# Altium schematic sheet Atmaca.SchDoc
size A4
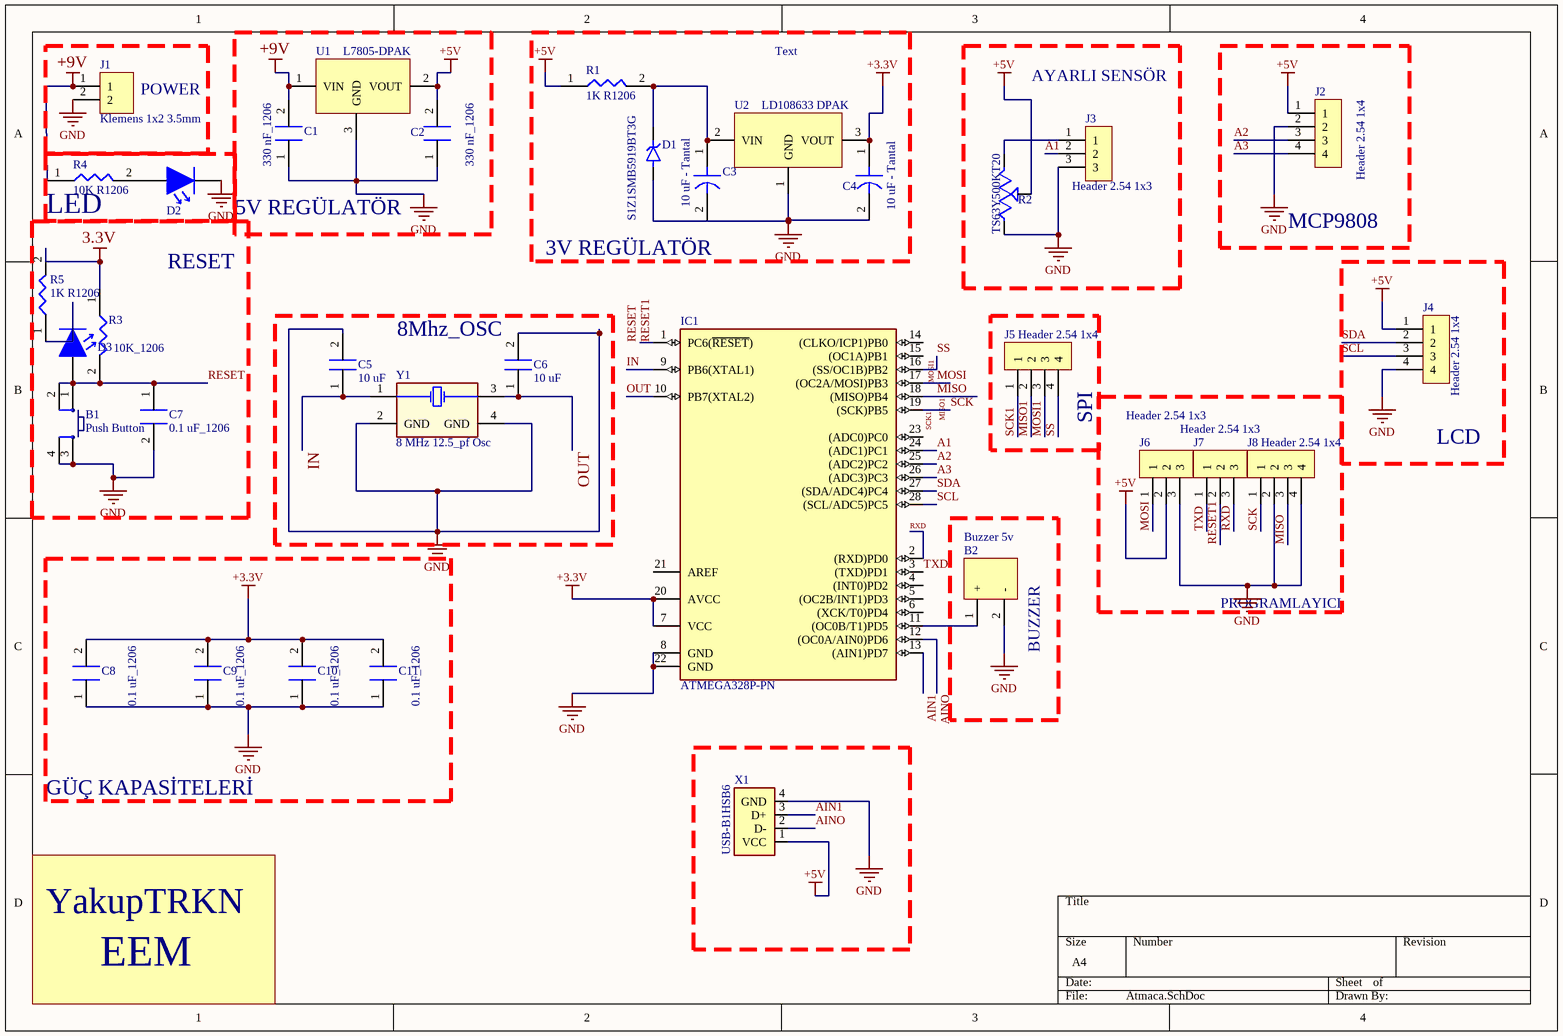
[diagram p0: Atmaca.SchDoc]

## Parts
B1  Push Button  [PUSB BUTTON-SMD]
B2  Buzzer 5v  [Buzzer 5v]
C1  330 nF_1206  [C1206]
C2  330 nF_1206  [C1206]
C3  10 uF - Tantal  [C1206- TANTAL]
C4  10 uF - Tantal  [C1206- TANTAL]
C5  10 uF  [C1206]
C6  10 uF  [C1206]
C7  0.1 uF_1206  [C1206]
C8  0.1 uF_1206  [C1206]
C9  0.1 uF_1206  [C1206]
C10  0.1 uF_1206  [C1206]
C11  0.1 uF_1206  [C1206]
D1  S1Z1SMB5919BT3G  [DIOM5436X247N]
D2  LTST-C171GKT  [LED_GREEN_0805]  (value not drawn)
D3  LH R974-LP-1  [LED_RED_0805]  (value not drawn)
IC1  ATMEGA328P-PN  [DIL28]
J1  Klemens 1x2 3.5mm  [Klemens 1x2 - 3.5mm]
J2  Header 2.54 1x4  [Header 2.54 1x4]
J3  Header 2.54 1x3  [Header 2.54 1x3]
J4  Header 2.54 1x4  [Header 2.54 1x4]
J5  Header 2.54 1x4  [Header 2.54 1x4]
J6  Header 2.54 1x3  [Header 2.54 1x3]
J7  Header 2.54 1x3  [Header 2.54 1x3]
J8  Header 2.54 1x4  [Header 2.54 1x4]
R1  1K R1206  [R1206 Resıstor]
R2  TS63Y500KT20  [TRIM_TS63Y500KT20]
R3  10K_1206  [R1206 Resıstor]
R4  10K R1206  [R1206 Resıstor]
R5  1K R1206  [R1206 Resıstor]
U1  L7805-DPAK  [DPAK228P972X230-3N]
U2  LD108633 DPAK  [DPAK228P972X230-3N]
X1  USB-B1HSB6  [OST_USB-B1HSB6]
Y1  8 MHz 12.5_pf Osc  [8 MHZ Osc.]

## Nets
3.3V: R3.1 R5.2
+3.3V: C4.1 C8.2 C9.2 C10.2 C11.2 IC1.7(VCC) IC1.20(AVCC) U2.3(VOUT)
+5V: C2.2 J2.1 J4.1 J6.2 R1.1 R2.2(B) U1.2(VOUT) X1.1(VCC)
+9V: C1.2 J1.1 R4.1 U1.1(VIN)
GND: B1.3 B1.4 B2.2(-) C1.1 C2.1 C4.2 C5.2 C6.2 C7.2 C8.1 C9.1 C10.1 C11.1 D1.A D2.1 IC1.8(GND) IC1.22(GND) J1.2 J2.2 J3.3 J4.4 J6.3 J8.2 J8.4 R2.1(A) U1.3(GND) U2.1(GND) X1.4(GND) Y1.2(GND) Y1.4(GND)
A1: IC1.24((ADC1)PC1) J3.2
A2: IC1.25((ADC2)PC2) J2.3
A3: IC1.26((ADC3)PC3) J2.4
AIN1: IC1.13((AIN1)PD7) X1.3(D+)
AINO: IC1.12((OC0A/AIN0)PD6) X1.2(D-)
IN: C5.1 IC1.9(PB6(XTAL1)) Y1.1
MISO: IC1.18((MISO)PB4) J5.2 J8.3  [also labelled MISO1]
MOSI: IC1.17((OC2A/MOSI)PB3) J5.3 J6.1  [also labelled MOSI1]
OUT: C6.1 IC1.10(PB7(XTAL2)) Y1.3
RESET: B1.1 B1.2 C7.1 D3.2 IC1.1(PC6(~{RESET})) J7.2 R3.2  [also labelled RESET1]
RXD: IC1.2((RXD)PD0) J7.3
SCK: IC1.19((SCK)PB5) J5.1 J8.1  [also labelled SCK1]
SCL: IC1.28((SCL/ADC5)PC5) J4.3
SDA: IC1.27((SDA/ADC4)PC4) J4.2
SS: IC1.16((SS/OC1B)PB2) J5.4
TXD: IC1.3((TXD)PD1) J7.1
NetB2_1: B2.1(+) IC1.11((OC0B/T1)PD5)
NetC3_1: C3.1 D1.C(K) R1.2 U2.2(VIN)
NetD2_2: D2.2 R4.2
NetD3_1: D3.1 R5.1
NetJ3_1: J3.1 R2.3(C)

Not connected (* = marked no-connect by the designer): C3 2; IC1 4((INT0)PD2) 5((OC2B/INT1)PD3) 6((XCK/T0)PD4) 14((CLKO/ICP1)PB0) 15((OC1A)PB1) 21(AREF) 23((ADC0)PC0)

## Notes on the sheet
- (near J1) POWER
- Text
- AYARLI SENSÖR
- (near R4) LED
- 5V REGÜLATÖR
- MCP9808
- RESET
- 3V REGÜLATÖR
- 8Mhz_OSC
- (near J5) SPI
- LCD
- (near B2) BUZZER
- PROGRAMLAYICI
- GÜÇ KAPASİTELERİ
- YakupTRKN
- EEM

## Library data of the parts
B1 = Push Button: Smd Push Button; Satın Alma Linki: https://urun.n11.com/diger/mini-pushbutton-switch-smd-P227461537?gclid=Cj0KCQjwkoDmBRCcARIsAG3xzl8Y_-jeD7HocNM6lvuZ_rVp83568XPGtNzlPwXWLph8oCRqo0yh87UaApZYEALw_wcB&gclsrc=aw.ds
C1 C2 = 330 nF C1206
C7-C11 = 0.1 uF C1206
D1 = S1Z1SMB5919BT3G: Zener Diode 5.6V 3W Â±5% Surface Mount SMB; MF: {'manufacturer': u'ON Semiconductor'}; Availability: Unavailable; MP: S1Z1SMB5919BT3G; Value: *; Package: None; Price: None
D2 = LED GREEN 0805: Green 0805 130 º Min 5 mcd Typical 12 mcd Water Clear Lens SMT LED; Manufacturer: Vishay Lite-On; Designed by: BERK; Lens Color: Colorless; Viewing Angle: 130°; Lens Style: Diffused,Colorless,Rectangular,Clear; Luminous Intensity: 12mcd; Forward Current: 30mA; Forward Voltage: 2.1V; Power Rating: 100mW; Dominant Wavelength: 569nm; Test Current: 10mA; Number of Elements: 1; Wavelength: 585nm; Reverse Voltage: 5V; Supplier 1: Digi-Key; Manufacturer Part Number: LTST-C171GKT; RoHS: Yes; Category: LEDs; Stock 1: 159023; Pricing 1: 1=0,26000, 10=0,14100, 100=0,06560, 500=0,06060, 1000=0,04747 (USD); Mount: Surface Mount; Case/Package: 0805; Number of Pins: 2; Color: Green; Case Code (Metric): 2012; Case Code (Imperial): 0805; Min Operating Temperature: -55°C; Max Operating Temperature: 85°C; Package Quantity: 1; Packaging: Tape and Reel; Illumination Color: Green; Lens Transparency: Clear; Power Dissipation: 100mW; Number of LEDs: 1; Series: CHIPLED 0805; Length: 2mm; Width: 1.25mm; Height: 0.8mm; Depth: 1.25mm; Radiation Hardening: No; Lead Free: Lead Free; RoHS Compliant: Yes; ComponentLink1URL: https://datasheet.ciiva.com/2110/ltst-c171gkt-2110000.pdf?src-supplier=Digi-Key; ComponentLink1Description: https://datasheet.ciiva.com/2110/ltst-c171gkt-2110000.pdf?src-supplier=Digi-Key; ComponentLink2URL: https://datasheet.ciiva.com/11773/0900766b80dc0296-11773991.pdf?src-supplier=RSComponents; ComponentLink2Description: https://datasheet.ciiva.com/11773/0900766b80dc0296-11773991.pdf?src-supplier=RSComponents; ComponentLink3URL: https://datasheet.ciiva.com/12400/lite-on-ltst-c171gkt-190133-12400647.pdf?src-supplier=Mouser; ComponentLink3Description: https://datasheet.ciiva.com/12400/lite-on-ltst-c171gkt-190133-12400647.pdf?src-supplier=Mouser; ComponentLink4URL: https://datasheet.ciiva.com/2110/ltst-c171gkt-2110001.pdf?src-supplier=Digi-Key; ComponentLink4Description: https://datasheet.ciiva.com/2110/ltst-c171gkt-2110001.pdf?src-supplier=Digi-Key; ComponentLink5URL: https://datasheet.ciiva.com/2110/ltst-c171gkt-2110002.pdf?src-supplier=Digi-Key; ComponentLink5Description: https://datasheet.ciiva.com/2110/ltst-c171gkt-2110002.pdf?src-supplier=Digi-Key; ComponentLink6URL: https://datasheet.ciiva.com/16396/ltst-c171gkt-16396549.pdf?src-supplier=Future+Electronics; ComponentLink6Description: https://datasheet.ciiva.com/16396/ltst-c171gkt-16396549.pdf?src-supplier=Future+Electronics; Supplier Part Number 1: 160-1423-1-ND
D3 = LED RED 0805: LED Uni-Color Hyper Red 660nm 2-Pin Chip 0805(2012Metric) T/R; Manufacturer: Osram Opto; Lens Color: White; Forward Voltage: 1.8V; Lens Style: Diffused,Flat,Colorless; Luminous Intensity: 71mcd; Viewing Angle: 160°; Forward Current: 30mA; Dominant Wavelength: 645nm; Number of Elements: 1; Test Current: 20mA; Reverse Voltage: 5V; Lens Transparency: Diffused; Luminous Flux: 0.17lm; Lens Size: 1.25mm; Designed by: BERK; Supplier 1: Digi-Key; Manufacturer Part Number: LH R974-LP-1; RoHS: Yes; Category: LEDs; Stock 1: 35632; Pricing 1: 1=0,26000, 10=0,13900, 100=0,06480, 500=0,05978, 1000=0,04683, 2000=0,04584 (USD); Mount: Surface Mount; Case/Package: 0805; Number of Pins: 2; Color: Red; Case Code (Imperial): 0805; Case Code (Metric): 2012; Min Operating Temperature: -30°C; Max Operating Temperature: 85°C; Packaging: Tape and Reel; Illumination Color: Red; Package Quantity: 1; Series: CHipLED; Length: 2.1mm; Width: 1.25mm; Depth: 1.35mm; Radiation Hardening: No; RoHS Compliant: Yes; ComponentLink1URL: http://www.jameco.com/Jameco/Products/ProdDS/2085634.pdf?src-supplier=Jameco; ComponentLink1Description: http://www.jameco.com/Jameco/Products/ProdDS/2085634.pdf?src-supplier=Jameco; ComponentLink2URL: http://components.arrow.com/part/dataview/0323_01825492?src-supplier=Arrow+Europe; ComponentLink2Description: http://components.arrow.com/part/dataview/0323_01825492?src-supplier=Arrow+Europe; ComponentLink3URL: https://dammedia.osram.info/media/resource/hires/osram-dam-2493888/LH%20R974.pdf?src-supplier=Digi-Key; ComponentLink3Description: https://dammedia.osram.info/media/resource/hires/osram-dam-2493888/LH%20R974.pdf?src-supplier=Digi-Key; ComponentLink4URL: http://www.mouser.com/ds/2/311/LH%20R974%20-%20CHIPLED%200805-318659.pdf?src-supplier=Mouser; ComponentLink4Description: http://www.mouser.com/ds/2/311/LH%20R974%20-%20CHIPLED%200805-318659.pdf?src-supplier=Mouser; ComponentLink5URL: https://www.verical.com/server-webapp/html/getDatasheet?partID=258950&src-supplier=Verical; ComponentLink5Description: https://www.verical.com/server-webapp/html/getDatasheet?partID=258950&src-supplier=Verical; ComponentLink6URL: http://components.arrow.com/part/dataview/41971690S1077610N9133?src-supplier=Arrow+Electronics; ComponentLink6Description: http://components.arrow.com/part/dataview/41971690S1077610N9133?src-supplier=Arrow+Electronics; ComponentLink7URL: http://components.arrow.com/part/dataview/41971690S6190115N2128?src-supplier=Arrow+Electronics; ComponentLink7Description: http://components.arrow.com/part/dataview/41971690S6190115N2128?src-supplier=Arrow+Electronics; Supplier Part Number 1: 475-1415-1-ND
IC1 = ATMEGA328P-PN: Atmel ATmega48/88/168/328 AVR Microcontroller; MF: {'manufacturer': u'Microchip'}; Availability: Unavailable; MP: ATMEGA328P-PN; Price: None; Package: None; Value: *
R2 = TS63Y500KT20: MF: {'manufacturer': u'Vishay Dale'}; Availability: Unavailable; Price: None; MP: TS63Y500KT20; Package: None; Value: *
R3 = 10K R1206
U1 = L7805-DPAK: L7805 5V REGULATOR. SMD PAKET
U2 = LD108633 DPAK: LD1086 3.3V REGULATOR
X1 = USB-B1HSB6: Conn Usb Type b r/a Black; MF: {'manufacturer': u'On Shore'}; Availability: Unavailable; MP: USB-B1HSB6; Price: None; Package: None; Value: *
Y1 = 8 MHz 12.5 pf Osc